# EasyEDA Pro project Access Control Core.eprj, board V2.1.0 Core PCB
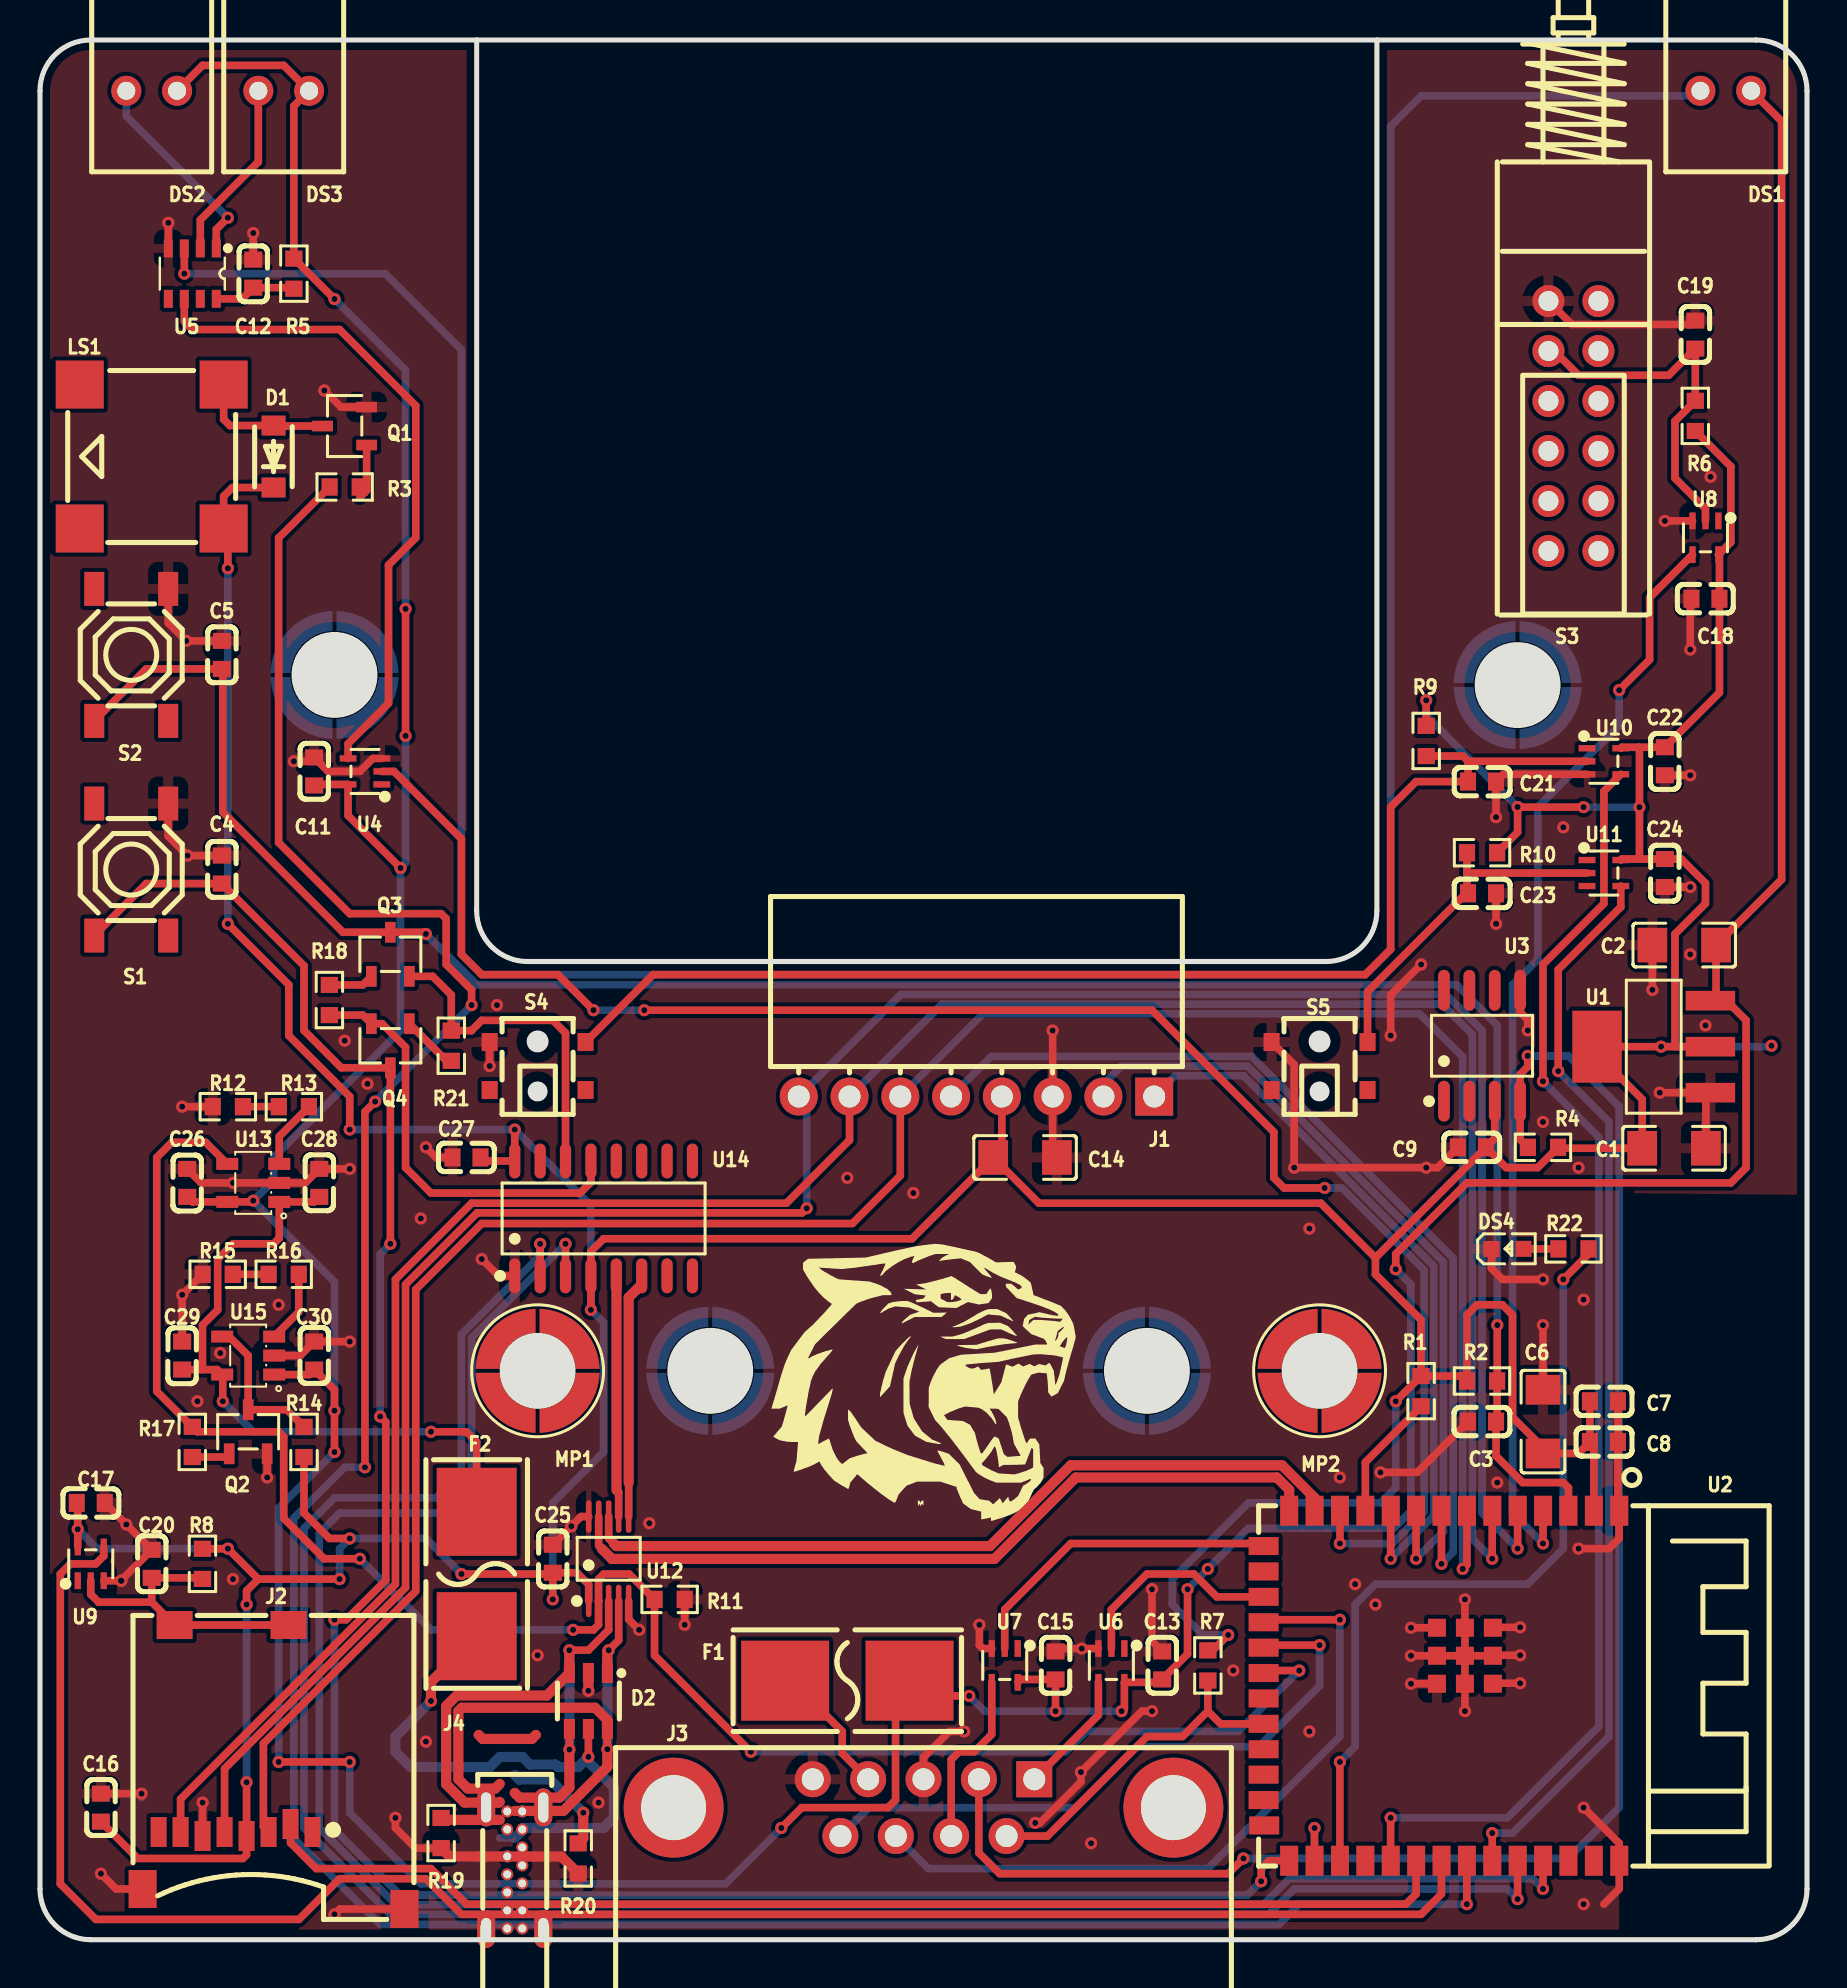
[diagram p7: board, top side]
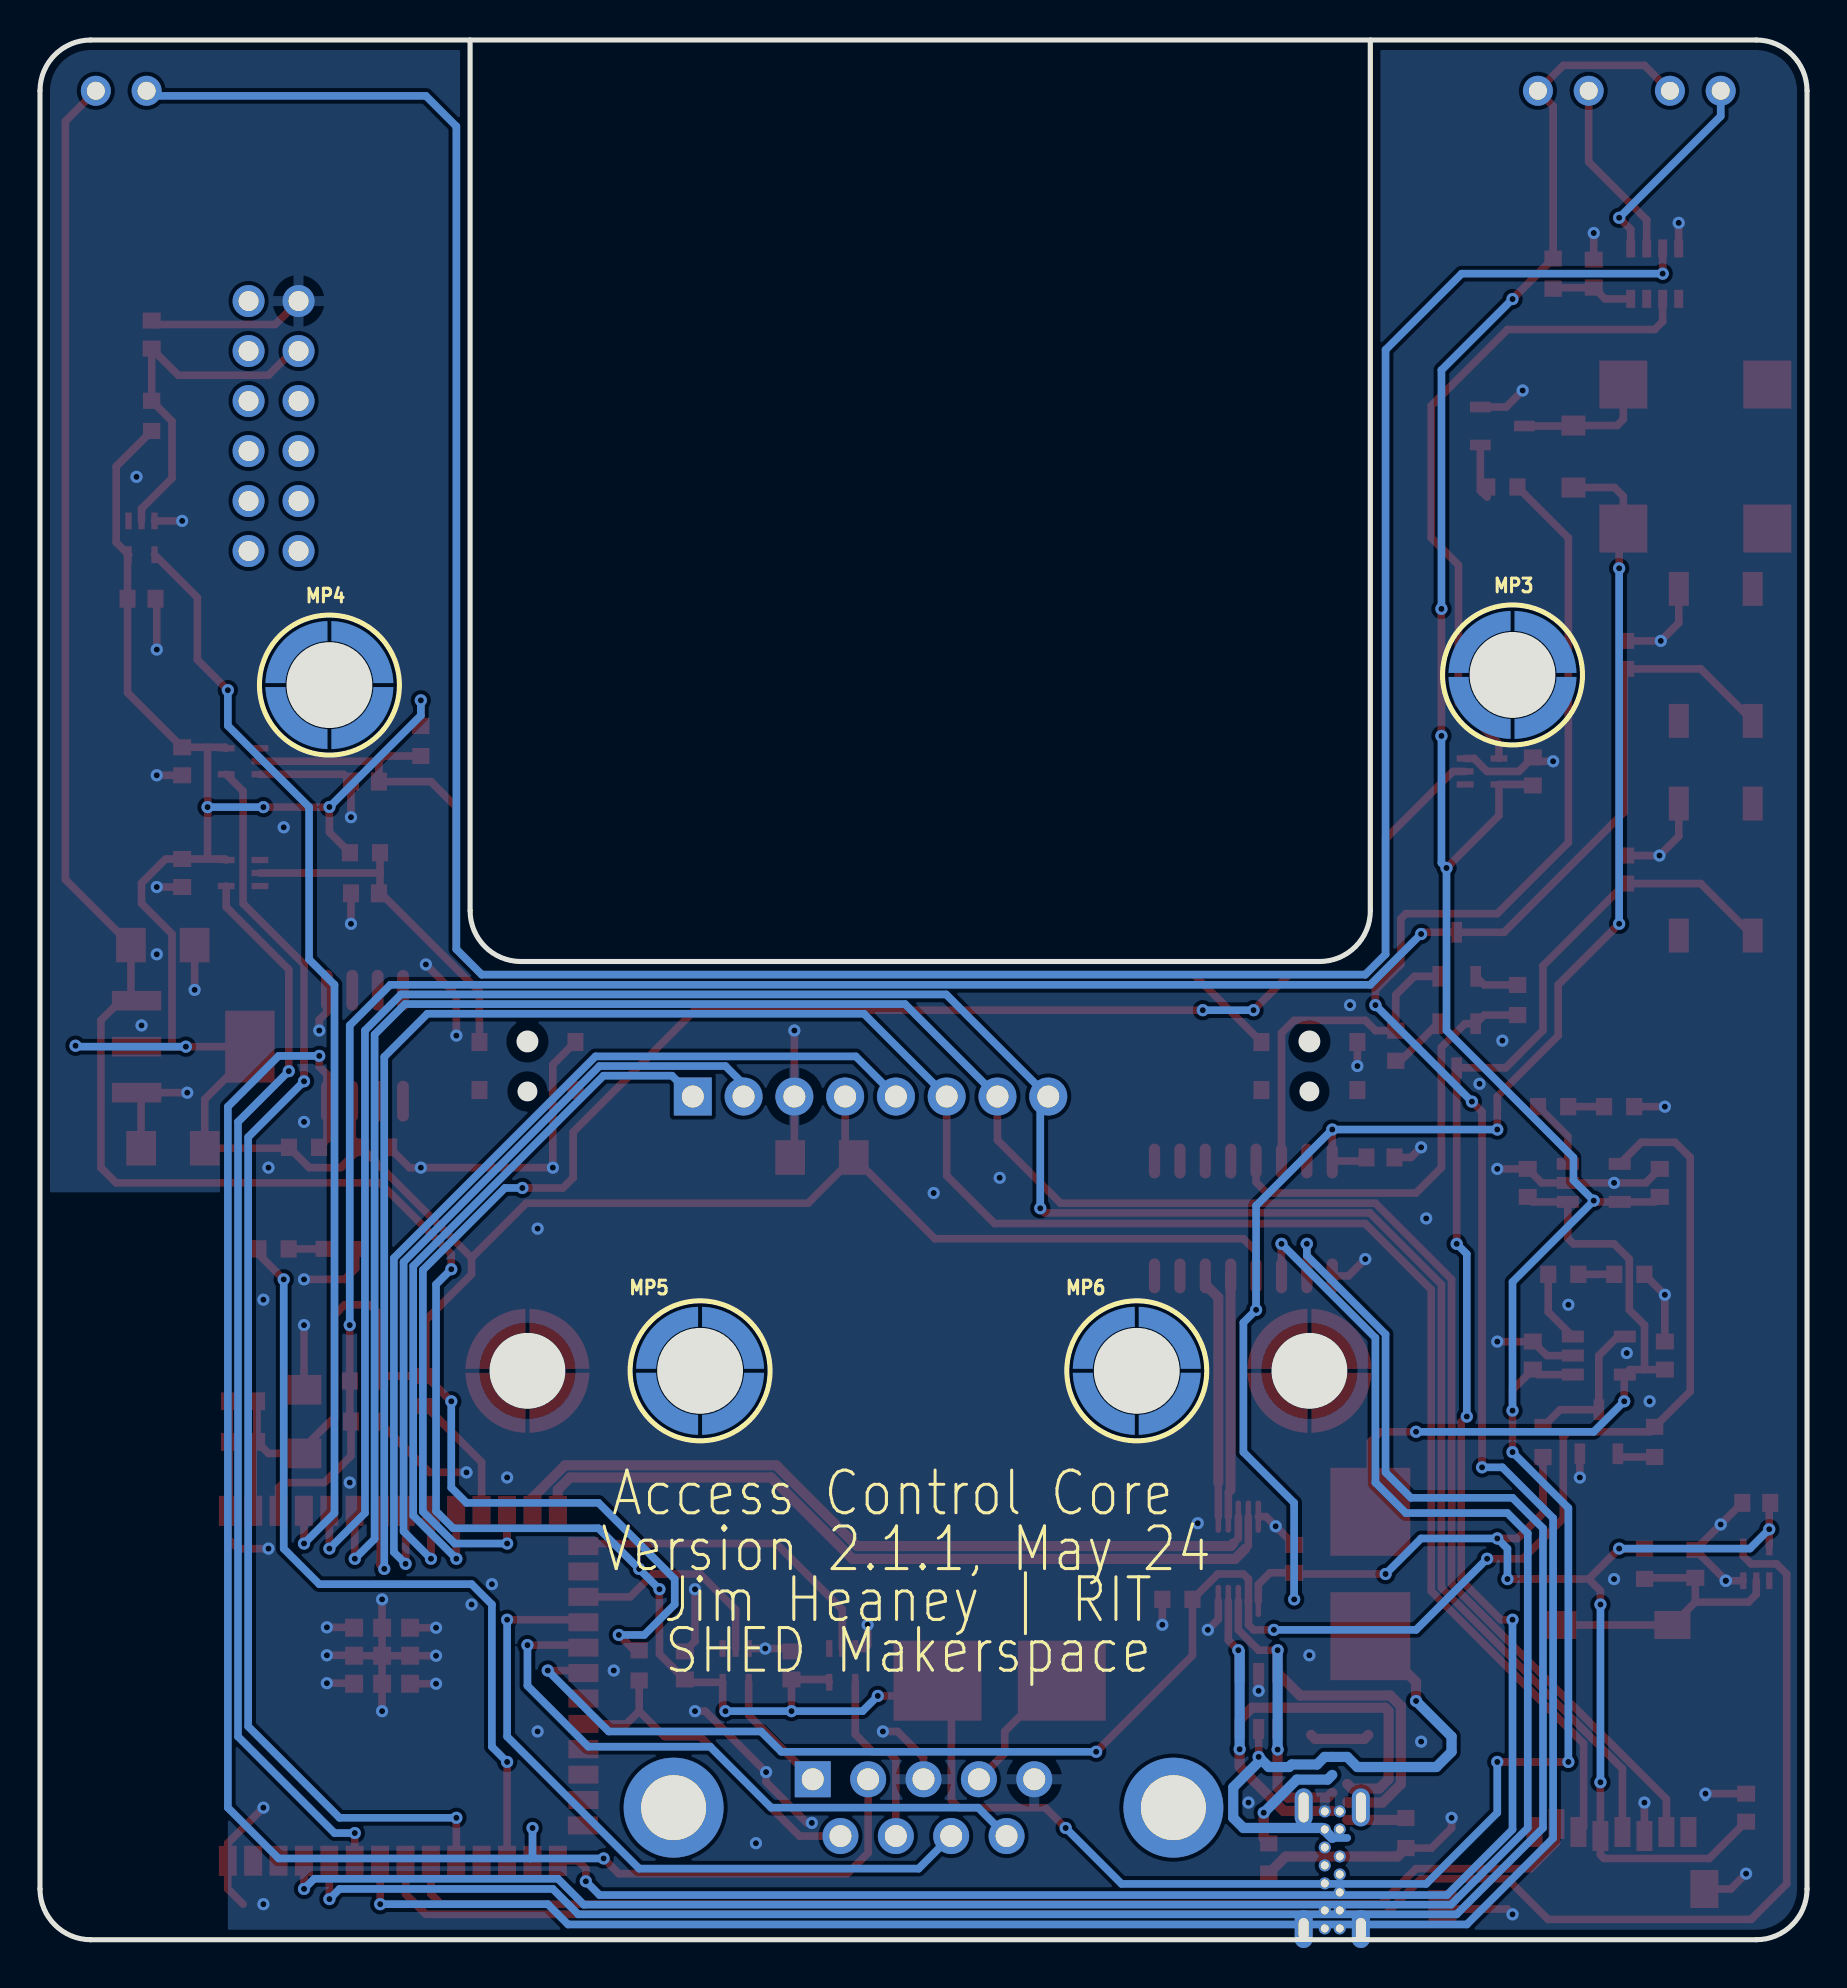
[diagram p8: board, bottom side, seen from below]

Outline 88.39 x 95 mm; copper layers: Top Layer, Bottom Layer. Coordinates in mm from the lower left corner of the outline.
Outline path: 21.84,95 21.84,51.46 arc(22.59,49.66) 24.38,48.92 64.34,48.92 arc(66.13,49.66) 66.88,51.46 66.88,95 ; 0,92.46 0,2.54 arc(0.74,0.74) 2.54,0 85.85,0 arc(87.65,0.74) 88.39,2.54 88.39,92.46 arc(87.65,94.25) 85.85,95 2.54,95 arc(0.74,94.25) 0,92.46
Stack: Top Layer 0.035mm / Dielectric1 1.51mm FR4 er 4.5 / Bottom Layer 0.035mm

## Design rules (mm)
template: Custom Config
spacing copperThickness1oz (default): track to track 0.102, other pairs 0.152 to 0.5
spacing copperThickness2oz: track to track 0.203, other pairs 0.152 to 0.3
track width copperThickness1oz (default): min 0.127, default 0.254, max 2.54
track width copperThickness2oz: min 0.203, default 0.254, max 2.54
differential pair differentialPair (default): width min 0.127, default 0.254, max 2.54; gap min 0.152, default 0.152
via viaSize (default): diameter min 0.5, default 0.61, max 10; hole min 0.3, default 0.305, max 6.3

## Placement (name value [footprint] x y rotation side)
C1  22uF  [C1206]  81.74 39.58 180 top
C2  22uF  [C1206]  82.25 49.74 0 top
C3  1uF  [C0603]  72.14 25.91 0 top
C4  100nF  [C0603]  9.1 53.51 270 top
C5  100nF  [C0603]  9.1 64.25 270 top
C6  22uF  [C1206]  75.18 25.91 270 top
C7  1uF  [C0603]  78.23 26.92 180 top
C8  100nF  [C0603]  78.23 24.89 180 top
C9  100nF  [C0603]  71.63 39.62 0 top
C11  100nF  [C0603]  13.72 58.42 270 top
C12  1uF  [C0603]  10.67 83.31 90 top
C13  100nF  [C0603]  56.13 13.72 270 top
C14  22uF  [C1206]  49.28 39.12 180 top
C15  100nF  [C0603]  50.8 13.72 270 top
C16  100nF  [C0603]  3.05 6.6 270 top
C17  100nF  [C0603]  2.54 21.84 180 top
C18  100nF  [C0603]  83.31 67.06 0 top
C19  100nF  [C0603]  82.8 80.26 270 top
C20  100nF  [C0603]  5.59 18.8 270 top
C21  100nF  [C0603]  72.14 57.91 180 top
C22  100nF  [C0603]  81.28 58.93 90 top
C23  100nF  [C0603]  72.14 52.32 180 top
C24  100nF  [C0603]  81.28 53.34 90 top
C25  100nF  [C0603]  25.65 19.05 90 top
C26  10uF  [C0603]  7.37 37.85 90 top
C27  100nF  [C0603]  21.34 39.12 0 top
C28  10uF  [C0603]  13.97 37.85 270 top
C29  10uF  [C0603]  7.11 29.21 90 top
C30  10uF  [C0603]  13.72 29.21 270 top
D1  SM4007PL  [SOD-123F_L2.8-W1.8-LS3.7-RD]  11.68 74.17 90 top
D2  SRV05-4-P-T7  [SOT-23-6_L2.9-W1.6-P0.95-LS2.8-BR]  27.43 11.94 90 top
DS1  MHK1560UBBTD  [LED-TH_MHK1560UGBTD]  84.33 92.46 180 top
DS2  MHK1560CRBTD  [LED-TH_MHK1560UGBTD]  5.59 92.46 180 top
DS3  MHK1560UGBTD  [LED-TH_MHK1560UGBTD]  12.19 92.46 180 top
DS4  KT-0603R  [LED0603-RD]  73.41 34.54 0 top
F1  0154001.DR  [FUSE-SMD_L9.8-W5.1]  40.39 12.95 180 top
F2  0154001.DR  [FUSE-SMD_L9.8-W5.1]  21.84 18.29 90 top
J1  PM254-1-08-W-8.5  [HDR-TH_8P-P2.54-H-F-W10.0-N]  46.85 42.16 180 top
J2  TF-05  [TF-SMD_TF-05]  11.68 8.64 0 top
J3  D-SUB-DR-9PCM-CB  [DB9-TH_ID09S33E4GV00LF]  44.2 6.6 0 top
J4  XUBF-0314-0907  [TYPE-C-TH_TYPE-C-14P-CC-2.6]  23.75 4.19 0 top
LS1  2.7kHz  [BUZ-SMD_4P-L8.5-W8.5-P8.50-TL]  5.59 74.17 180 top
MP1  SMTSO2070CTJ  [SMD_BD5.6-L5.6-W5.6-D3.6]  24.89 28.45 0 top
MP2  SMTSO2070CTJ  [SMD_BD5.6-L5.6-W5.6-D3.6]  64.01 28.45 0 top
MP3  SMTSO3030CTJ  [SMD_BD5.6-D4.1]  14.73 63.25 0 bottom
MP4  SMTSO3030CTJ  [SMD_BD5.6-D4.1]  73.91 62.74 90 bottom
MP5  SMTSO3030CTJ  [SMD_BD5.6-D4.1]  55.37 28.45 180 bottom
MP6  SMTSO3030CTJ  [SMD_BD5.6-D4.1]  33.53 28.45 180 bottom
Q1  S8050 J3Y  [SOT-23-3_L3.0-W1.7-P0.95-LS2.9-BR]  15.24 75.69 0 top
Q2  S8050 J3Y  [SOT-23-3_L3.0-W1.7-P0.95-LS2.9-BR]  10.41 25.4 270 top
Q3  S8050 J3Y  [SOT-23-3_L3.0-W1.7-P0.95-LS2.9-BR]  17.53 49.28 270 top
Q4  S8050 J3Y  [SOT-23-3_L3.0-W1.7-P0.95-LS2.9-BR]  17.53 44.7 90 top
R1  10kΩ  [R0603]  69.09 27.43 90 top
R2  10kΩ  [R0603]  72.14 27.94 180 top
R3  1kΩ  [R0603]  15.24 72.64 0 top
R4  4.7kΩ  [R0603]  75.18 39.62 0 top
R5  150Ω  [R0603]  12.7 83.31 90 top
R6  100kΩ  [R0603]  82.8 76.2 270 top
R7  5.1kΩ  [R0603]  58.42 13.72 90 top
R8  100kΩ  [R0603]  8.13 18.8 270 top
R9  100kΩ  [R0603]  69.34 59.94 90 top
R10  100kΩ  [R0603]  72.14 54.36 0 top
R11  10kΩ  [R0603]  31.5 17.02 180 top
R12  1kΩ  [R0603]  9.4 41.66 0 top
R13  5.1kΩ  [R0603]  12.7 41.66 180 top
R14  10kΩ  [R0603]  13.21 24.89 90 top
R15  1kΩ  [R0603]  8.89 33.27 0 top
R16  5.1kΩ  [R0603]  12.19 33.27 180 top
R17  10kΩ  [R0603]  7.62 24.89 90 top
R18  10kΩ  [R0603]  14.48 46.99 90 top
R19  5.1kΩ  [R0603]  20.07 5.33 90 top
R20  5.1kΩ  [R0603]  26.92 4.06 90 top
R21  10kΩ  [R0603]  20.57 44.7 270 top
R22  4.7kΩ  [R0603]  76.71 34.54 0 top
S1  TS-1187A-B-A-B  [SW-SMD_4P-L5.1-W5.1-P3.70-LS6.5-TL-2]  4.56 53.51 90 top
S2  TS-1187A-B-A-B  [SW-SMD_4P-L5.1-W5.1-P3.70-LS6.5-TL-2]  4.56 64.25 90 top
S3  SPUJ194500  [SW-TH_SPUJ194500]  76.71 75.69 90 top
S4  TS-103  [SW-SMD_TS-103]  24.89 43.69 90 top
S5  TS-103  [SW-SMD_TS-103]  64.01 43.69 90 top
U1  AMS1117-3.3  [SOT-223-4_L6.5-W3.5-P2.30-LS7.0-BR]  80.72 44.66 0 top
U2  2.4GHz  [WIRELM-SMD_ESP32-S3-WROOM-1]  70.1 12.7 270 top
U3  DS18B20Z+T&R  [SOIC-8_L4.9-W3.9-P1.27-LS6.0-BL]  72.14 44.7 0 top
U4  74LVC1G17GW,125  [SOT-353_L2.1-W1.3-P0.65-LS2.3-BR]  16.26 58.42 0 top
U5  WS2811F  [FSOP-8_L3.3-W1.7-P0.80-LS2.9-BL]  7.62 83.31 180 top
U6  74LVC1G17GW,125  [SOT-353_L2.1-W1.3-P0.65-LS2.3-BR]  53.59 13.72 90 top
U7  74LVC1G17GW,125  [SOT-353_L2.1-W1.3-P0.65-LS2.3-BR]  48.26 13.72 90 top
U8  74LVC1G17GW,125  [SOT-353_L2.1-W1.3-P0.65-LS2.3-BR]  83.31 70.1 90 top
U9  74LVC1G17GW,125  [SOT-353_L2.1-W1.3-P0.65-LS2.3-BR]  2.54 18.8 270 top
U10  74LVC1G17GW,125  [SOT-353_L2.1-W1.3-P0.65-LS2.3-BR]  78.23 58.93 180 top
U11  74LVC1G17GW,125  [SOT-353_L2.1-W1.3-P0.65-LS2.3-BR]  78.23 53.34 180 top
U12  FSUSB42MUX  [MSOP-10_L3.0-W3.0-P0.50-LS5.0-BL]  28.45 19.05 0 top
U13  MT9700  [SOT-23-5_L3.0-W1.7-P0.95-LS2.8-BR]  10.67 37.85 0 top
U14  CH340C  [SOP-16_L10.0-W3.9-P1.27-LS6.0-BL]  28.19 36.07 0 top
U15  MT9700  [SOT-23-5_L3.0-W1.7-P0.95-LS2.8-BR]  10.41 29.21 0 top

## Footprints (pads in the part's own frame, mm; a bottom-side part is the same pattern mirrored in y, then rotated)
BUZ-SMD_4P-L8.5-W8.5-P8.50-TL
  rect 2.4x2.4 smd: 1(-3.6,3.6) 2(-3.6,-3.6) 3(3.599,-3.599) 4(3.6,3.6)
C0603
  rect 0.8x0.9 smd: 1(-0.7,0) 2(0.7,0)
C1206
  rect 1.485x1.728 smd: 1(-1.593,0) 2(1.593,0)
DB9-TH_ID09S33E4GV00LF
  rect 1.8x1.8 hole 1.1: 1(5.54,1.42)
  round 1.8 hole 1.1: 2(2.77,1.42) 3(0,1.42) 4(-2.77,1.42) 5(-5.54,1.42) 6(4.155,-1.42) 7(1.385,-1.42) 8(-1.385,-1.42) 9(-4.155,-1.42)
  round 5 hole 3.25: 10(-12.5,0) 11(12.5,0)
FSOP-8_L3.3-W1.7-P0.80-LS2.9-BL
  rect 0.45x0.9 smd: 1(-1.2,-1.26) 2(-0.4,-1.26) 3(0.4,-1.26) 4(1.2,-1.26) 5(1.2,1.26) 6(0.4,1.26) 7(-0.4,1.26) 8(-1.2,1.26)
FUSE-SMD_L9.8-W5.1
  rect 4.4x4 smd: 1(-3.11,0) 2(3.11,0)
HDR-TH_8P-P2.54-H-F-W10.0-N
  rect 1.9x1.9 hole 1.1: 1(-8.89,0)
  round 1.9 hole 1.1: 2(-6.35,0) 3(-3.81,0) 4(-1.27,0) 5(1.27,0) 6(3.81,0) 7(6.35,0) 8(8.89,0)
LED0603-RD
  rect 0.8x0.8 smd: 1(-0.799,-0.004) 2(0.799,0.004)
LED-TH_MHK1560UGBTD
  round 1.5 hole 0.9: 1(1.27,0) 2(-1.27,0)
MSOP-10_L3.0-W3.0-P0.50-LS5.0-BL
  oval 0.28x1.62 smd: 1(-1,-2.11) 2(-0.5,-2.11) 3(0,-2.11) 4(0.5,-2.11) 5(1,-2.11) 6(1,2.11) 7(0.5,2.11) 8(0,2.11) 9(-0.5,2.11) 10(-1,2.11)
R0603
  rect 0.806x0.864 smd: 1(-0.753,0) 2(0.753,0)
SMD_BD5.6-D4.1
  custom 3.1x3.1 smd: 1(-2.102,1.65) 2(1.65,2.102) 3(2.102,-1.65) 4(-1.65,-2.102)
SMD_BD5.6-L5.6-W5.6-D3.6
  custom 3x3 smd: 1(-1.844,1.6) 1(-1.601,-1.844) 1(1.6,1.844) 1(1.844,-1.6)
SOD-123F_L2.8-W1.8-LS3.7-RD
  rect 1x1.2 smd: 1(-1.55,0) 2(1.55,0)
SOIC-8_L4.9-W3.9-P1.27-LS6.0-BL
  oval 0.588x2.045 smd: 1(-1.905,-2.772) 2(-0.635,-2.772) 3(0.635,-2.772) 4(1.905,-2.772) 5(1.905,2.772) 6(0.635,2.772) 7(-0.635,2.772) 8(-1.905,2.772)
SOP-16_L10.0-W3.9-P1.27-LS6.0-BL
  oval 0.56x1.745 smd: 1(-4.445,-2.873) 2(-3.175,-2.873) 3(-1.905,-2.873) 4(-0.635,-2.873) 5(0.635,-2.873) 6(1.905,-2.873) 7(3.175,-2.873) 8(4.445,-2.873) 9(4.445,2.873) 10(3.175,2.873) 11(1.905,2.873) 12(0.635,2.873) 13(-0.635,2.873) 14(-1.905,2.873) 15(-3.175,2.873) 16(-4.445,2.873)
SOT-23-3_L3.0-W1.7-P0.95-LS2.9-BR
  rect 1.038x0.532 smd: 1(1.101,-0.95) 2(1.101,0.95) 3(-1.101,0)
SOT-23-5_L3.0-W1.7-P0.95-LS2.8-BR
  rect 1.1x0.6 smd: 1(1.3,-0.95) 2(1.3,0) 3(1.3,0.95) 4(-1.3,0.95) 5(-1.3,-0.95)
SOT-23-6_L2.9-W1.6-P0.95-LS2.8-BR
  rect 1x0.55 smd: 1(1.4,-0.95) 2(1.4,0) 3(1.4,0.95) 4(-1.4,0.95) 5(-1.4,0) 6(-1.4,-0.95)
SOT-223-4_L6.5-W3.5-P2.30-LS7.0-BR
  rect 2.47x0.98 smd: 1(2.835,-2.3) 2(2.835,0) 3(2.835,2.3)
  rect 2.47x3.6 smd: 4(-2.835,0)
SOT-353_L2.1-W1.3-P0.65-LS2.3-BR
  rect 0.839x0.315 smd: 1(0.845,-0.65) 2(0.845,0) 3(0.845,0.65) 4(-0.845,0.65) 5(-0.845,-0.65)
SW-SMD_4P-L5.1-W5.1-P3.70-LS6.5-TL-2
  rect 1.7x1 smd: 1(-3.3,1.85) 2(3.3,1.85) 3(-3.3,-1.85) 4(3.3,-1.85)
SW-SMD_TS-103
  rect 0.9x0.8 smd: 1(1.2,2.4) 2(1.2,-2.4) 3(-1.2,2.4) 4(-1.2,-2.4)
SW-TH_SPUJ194500
  round 1.6 hole 1: 1(6.25,-1.25) 2(3.75,-1.25) 3(1.25,-1.25) 4(-1.25,-1.25) 5(-3.75,-1.25) 6(-6.25,-1.25) 7(6.25,1.25) 8(3.75,1.25) 9(1.25,1.25) 10(-1.25,1.25) 11(-3.75,1.25) 12(-6.25,1.25)
TF-SMD_TF-05
  rect 0.8x1.5 smd: 1(1.95,-3.25) 2(0.85,-2.85) 3(-0.25,-3.25) 4(-1.35,-3.45) 5(-2.45,-3.25) 6(-3.55,-3.45) 7(-4.65,-3.25) 8(-5.75,-3.25)
  rect 1.8x1.4 smd: 9(-4.95,7.1) 10(0.75,7.1)
  rect 1.4x1.9 smd: 11(-6.55,-6.1) 11(6.55,-7.1)
TYPE-C-TH_TYPE-C-14P-CC-2.6
  round 0.6 hole 0.4x0.42: A1(0.375,2.225) A4(0.375,1.325) A5(0.375,0.425) A6(0.375,-0.475) A7(0.375,-1.375) A9(0.375,-2.725) A12(0.375,-3.625) B1(-0.375,-3.625) B4(-0.375,-2.725) B5(-0.375,-1.825) B6(-0.375,-0.925) B7(-0.375,-0.025) B9(-0.375,1.325) B12(-0.375,2.225)
  oval 0.9x1.9 hole 0.5x1.5: SH1(1.43,2.425) SH2(-1.43,2.425)
  oval 0.9x1.9 hole 0.5x1.1: SH1(1.43,-3.655) SH2(-1.43,-3.655)
WIRELM-SMD_ESP32-S3-WROOM-1
  rect 1.5x0.9 smd: 1(-8.75,8.895) 2(-8.75,7.625) 3(-8.75,6.355) 4(-8.75,5.085) 5(-8.75,3.815) 6(-8.75,2.545) 7(-8.75,1.275) 8(-8.75,0.005) 9(-8.75,-1.265) 10(-8.75,-2.535) 11(-8.75,-3.805) 12(-8.75,-5.075) 13(-8.75,-6.345) 14(-8.75,-7.615) 27(8.75,-7.615) 28(8.75,-6.345) 29(8.75,-5.075) 30(8.75,-3.805) 31(8.75,-2.535) 32(8.75,-1.265) 33(8.75,0.005) 34(8.75,1.275) 35(8.75,2.545) 36(8.75,3.815) 37(8.75,5.085) 38(8.75,6.355) 39(8.75,7.625) 40(8.75,8.895)
  rect 0.9x1.5 smd: 15(-6.985,-8.895) 16(-5.715,-8.895) 17(-4.445,-8.895) 18(-3.175,-8.895) 19(-1.905,-8.895) 20(-0.635,-8.895) 21(0.635,-8.895) 22(1.905,-8.895) 23(3.175,-8.895) 24(4.445,-8.895) 25(5.715,-8.895) 26(6.985,-8.865)
  rect 0.9x0.9 smd: 41(-2.9,2.575) 41(-2.9,1.175) 41(-2.9,-0.225) 41(-1.5,2.575) 41(-1.5,1.175) 41(-1.5,-0.225) 41(-0.1,2.575) 41(-0.1,1.175) 41(-0.1,-0.225)

## Nets
As in the schematic, except:
GND: C1.1 C2.1 C3.1 C4.1 C5.1 C6.1 C7.1 C8.1 C9.1 C11.1 C12.2 C13.1 C14.1 C15.1 C16.1 C17.1 C18.1 C19.1 C20.1 C21.1 C22.1 C23.1 C24.1 C25.2 C26.2 C27.1 C28.1 C29.2 C30.1 D2.2 DS4.1 J1.3 J2.6 J2.11 J3.3 J3.5 J4.A1 J4.A12 J4.B1 J4.B12 J4.SH1 J4.SH2 Q1.2 Q2.2 R11.1 R12.1 R15.1 R19.1 R20.1 S1.4 S2.4 S3.7 S4.1 S5.1 U1.1 U2.1 U2.40 U2.41 U3.5 U4.3 U5.4 U6.3 U7.3 U8.3 U9.3 U10.3 U12.5 U12.10 U13.2 U14.1 U15.2

Pads without a net: J2 1 8; J3 10 11; LS1 3 4; MP1 1; MP2 1; MP3 1 2 3 4; MP4 1 2 3 4; MP5 1 2 3 4; MP6 1 2 3 4; S1 2 3; S2 2 3; S3 1 2 3 4 5 6 9 10 11 12; S4 3 4; S5 3 4; U2 16 21 23 24 25 26 30 38 39; U3 1 2 6 7 8; U4 1; U5 5 7; U6 1; U7 1; U8 1; U9 1; U10 1; U11 1 3; U14 7 8 9 10 11 12 15

## Via types
v1: diameter 0.61, hole 0.305, Top Layer to Bottom Layer, 181 vias

## Routing (per net, layer and track width the routed paths; a pad name or vN(x,y) marks a point on that pad's centre or on a via; arc(x,y) is an arc through that point)
+5V: length 283.4
  Top Layer w0.381: v1(54.1,11.43) 54.24,11.57 U6.5 55.99,12.87 C13.2 57.4,14.29 v1(57.4,17.53) ; C26.1 7.62,36.9 U13.5 10.47,36.9 10.54,36.96 v1(10.67,36.96) ; U7.5 49.05,13.02 C15.2 v1(50.8,11.43) ; v1(14.73,24.38) v1(14.73,26.46) 14.73,27.49 C30.2 13.47,28.26 U15.1 ; C11.2 13.77,57.77 U4.5 15.41,56.22 v1(18.03,53.59) ; v1(18.29,60.2) v1(18.29,66.55) ; v1(46.48,12.19) 44.26,12.19 F1.1 42.8,12.26 42.8,6.99 42.42,6.6 38.1,6.6 v1(37.08,5.59) ; v1(11.94,8.89) v1(15.49,8.89) ; v1(14.73,82.04) 12.71,84.07 R5.2 12.7,91.69 DS3.2 12.19,93.73 8.13,93.73 DS2.2 ; DS1.2 87.12,90.93 87.12,53.02 C2.2 83.84,47.24 U1.3 84.36,46.96 85.34,45.97 85.34,38.61 84.58,37.85 71.37,37.85 67.82,34.29 v1(67.82,33.53)
  Bottom Layer w0.381: v1(15.49,8.89) 15.49,6.35 19.05,2.79 34.29,2.79 v1(37.08,5.59) ; v1(18.29,66.55) 18.29,78.49 v1(14.73,82.04) ; v1(14.73,24.38) 11.94,21.59 v1(11.94,8.89) ; v1(18.29,60.2) 18.29,53.85 v1(18.03,53.59) 18.03,45.47 11.68,39.12 11.68,37.97 v1(10.67,36.96) 14.73,32.89 v1(14.73,26.46) ; v1(54.1,11.43) v1(50.8,11.43) 47.24,11.43 v1(46.48,12.19) ; v1(57.4,17.53) v1(58.42,18.54) 60.45,20.57 67.72,20.57 68.58,21.43 68.58,32.77 v1(67.82,33.53)
GND: length 201.3
  Top Layer w0.381: Q1.2 15.05,76.64 v1(14.22,77.47) ; C14.1 50.66,39.33 J1.3 v1(50.66,45.47) ; DS4.1 72.61,33.57 73.15,33.02 v1(75.18,33.02) ; v1(74.04,15.62) 72.7,15.62 72.68,15.6 ; v1(55.63,11.43) 55.12,11.43 v1(52.07,8.38) 52.07,7.89 50.03,5.84 v1(49.78,5.84) ; U2.41 v1(68.58,15.6) ; v1(74.42,45.47) 74.42,46.01 74.04,46.39 U3.5 ; v1(67.56,45.21) 67.56,47.24 v1(69.09,48.77) ; C9.1 69.91,38.61 v1(69.34,38.61) v1(62.74,38.61) 62.74,43.76 S5.1 ; v1(82.55,64.52) 82.55,66.99 C18.1 ; 6.41,67.55 6.41,65.85 v1(7.31,64.95) C5.1 ; v1(74.04,14.22) 72.7,14.22 72.68,14.2 U2.41 ; v1(12.7,58.93) 13.52,58.93 C11.1 14.42,58.42 16,58.42 16.65,59.07 U4.3 ; 6.41,56.81 6.41,55.18 v1(7.38,54.21) C4.1 ; C12.2 v1(10.67,85.34) ; v1(3.05,3.3) 3.81,2.54 J2.11 ; C2.1 v1(80.66,47.5) ; R12.1 v1(7.11,41.66) ; v1(46.23,10.41) 45.5,10.41 44.2,9.11 J3.3 ; C1.1 83.33,42.13 U1.1 v1(81.03,42.36) ; U2.41 v1(68.58,12.8) ; v1(22.1,34.04) 22.94,33.2 U14.1 ; U8.3 v1(81.28,70.95) ; S4.1 v1(22.49,43.69) ; U2.41 U2.41 v1(71.28,11.43) ; U2.41 U2.41 v1(68.58,14.2) ; U2.41 U2.41 v1(71.28,17.02) ; C25.2 v1(26.58,20.68) 27.06,21.16 U12.10 ; C27.1 19.81,39.12 v1(19.3,39.62) ; U10.3 73.2,58.28 C21.1 v1(72.84,56.13) ; v1(29.97,15.49) 29.45,16.02 U12.5 ; C17.1 v1(4.32,20.77) C20.1 4.06,17.97 v1(4.06,17.95) U9.3 ; S3.7 76.63,80.77 82.61,80.77 C19.1 ; J2.11 15,1.54 v1(14.73,1.27) ; v1(46.99,15.75) 46.99,14.73 47.16,14.56 U7.3 ; R15.1 v1(7.11,32.25) C29.2 ; C6.1 v1(75.18,30.73) ; v1(55.63,17.53) 55.63,14.92 C13.1 ; v1(74.04,12.83) 72.71,12.83 72.68,12.8 ; v1(76.96,19.56) 78.49,19.56 78.99,20.07 78.99,21.45 U2.1 78.93,21.52 C8.1 C7.1 ; J2.6 v1(8.13,6.86) ; C16.1 v1(5.08,7.3) ; v1(67.06,23.37) 68.9,23.37 C3.1 ; U15.2 13.02,29.21 C30.1 v1(15.49,29.91) ; C24.1 v1(82.55,52.64) ; U5.4 v1(6.42,85.85) ; 78.23,1.78 79,2.55 U2.40 79,4.82 v1(77.22,6.6) ; C23.1 v1(72.84,50.8) ; C22.1 v1(82.55,58.23) ; Q2.2 v1(11.36,23.11) ; U6.3 v1(52.11,14.56) 50.94,14.56 C15.1 ; C26.2 8.07,37.85 v1(9.65,37.85) U13.2 13.27,37.85 C28.1 v1(15.49,38.55) ; R19.1 18.79,4.58 17.78,5.59 v1(17.78,6.1) ; R11.1 v1(32.25,15.75)
  Top Layer w0.508: 21.94,10.24 22.14,10.04 24.6,10.04 24.8,10.24 ; R20.1 26.07,4.16 20.48,4.16 R19.1 ; D2.2 v1(27.43,12.45)
  Bottom Layer w0.381: v1(82.55,58.23) 82.55,58.17 ; v1(72.84,56.13) 72.9,56.13 ; v1(5.08,7.3) 5.08,7.11 ; v1(8.13,6.86) 8.13,6.86 ; v1(81.03,42.36) 81.03,42.42
  vias: v1(7.87,26.92) v1(9.02,29.34) v1(9.65,18.03) v1(11.94,31.75) v1(15.24,44.96) v1(16.38,42.8) v1(19.05,36.07) v1(19.3,9.91) v1(22.86,46.74) v1(24.89,14.22) v1(27.94,6.86) v1(30.48,20.83) v1(40.39,38.1) v1(43.69,37.34) v1(52.58,4.83) v1(59.69,13.46) v1(63.5,35.56) v1(63.5,10.41) v1(65.02,23.11) v1(65.79,17.78) v1(66.8,16.76) v1(72.9,22.86) v1(75.18,40.89) v1(76.2,55.63) v1(76.96,38.61) v1(77.22,32) v1(77.22,1.78) v1(82.55,49.28) v1(83.31,45.72) v1(83.57,73.15)
VCC: length 336.3
  Top Layer w0.381: C16.2 4.89,4.06 10.15,4.06 10.33,4.25 J2.4 v1(10.33,7.87) ; U3.3 72.77,40.07 C9.2 ; U10.5 79.13,59.63 79.99,59.63 ; 81.79,44.66 v1(81.09,44.66) U1.4 77.89,44.28 80.15,42.03 C1.2 75.98,39.58 R4.2 74.92,38.61 73.34,38.61 C9.2 ; 81.79,44.66 81.79,50.29 83.31,51.82 83.31,52.83 82.1,54.04 C24.2 80.01,54.04 ; 81.79,44.66 U1.2 ; C25.1 26.86,18.35 27.45,17.76 U12.1 ; C25.1 v1(25.65,17.02) ; C25.1 25.59,18.29 v1(21.08,18.29) ; C14.2 49.97,36.83 64.07,36.83 66.8,34.1 ; C14.2 43.62,35.05 28.19,35.05 27.56,34.42 U14.4 v1(27.56,31.5) ; C14.2 48.12,39.55 J1.4 ; 75.48,24.32 73.66,26.13 73.66,31.24 73.15,31.75 71.88,31.75 71.38,31.25 R2.2 71.14,28.19 R1.2 ; 75.48,24.32 C6.2 ; 75.48,24.32 76.96,24.32 C8.2 ; 80.01,54.04 79.13,54.04 U11.5 ; 80.01,54.04 v1(80.01,56.64) 80.01,59.61 79.99,59.63 ; C8.2 C7.2 ; C8.2 77.73,24.7 U2.2 ; v1(9.4,68.58) 9.4,70.36 LS1.1 9.19,72.18 9.63,72.62 D1.1 ; v1(14.99,18.03) 10.92,18.03 ; 10.92,18.03 9.41,19.55 ; 10.92,18.03 10.33,17.45 v1(10.33,16.76) ; R10.2 73.91,55.38 v1(73.91,56.64) 73.92,56.64 v1(77.22,56.64) ; 9.41,19.55 R8.1 ; 9.41,19.55 v1(9.4,19.56) ; R6.2 84.58,73.67 84.58,69.88 U8.5 84.01,69.21 C18.2 84.01,62.36 C22.2 79.99,59.63 ; v1(69.34,61.98) R9.2 ; R1.2 69.09,30.99 66.8,33.27 66.8,34.1 ; R1.2 69.08,28.19 v1(67.82,26.92) ; v1(15.49,20.07) 14.48,20.07 13.21,21.34 R14.1 ; v1(9.4,50.8) 12.45,47.75 12.45,45.21 15.49,42.16 v1(15.49,40.51) ; C9.2 66.8,34.1 ; v1(59.44,15.24) 58.67,14.47 R7.2 ; U9.5 v1(1.89,20.53) 1.89,21.79 C17.2 ; v1(23.75,40.51) U14.16 22.21,38.94 C27.2
  Bottom Layer w0.381: v1(59.44,15.24) 58.17,15.24 56.64,16.76 56.64,18.03 60.45,21.84 67.06,21.84 67.82,22.61 v1(67.82,26.92) ; v1(14.99,18.03) 14.99,19.56 v1(15.49,20.07) 19.3,20.07 v1(21.08,18.29) ; v1(81.09,44.66) 86.57,44.66 v1(86.61,44.7) ; v1(73.91,56.64) 69.34,61.21 v1(69.34,61.98) ; v1(9.4,19.56) 2.86,19.56 v1(1.89,20.53) ; v1(9.4,50.8) v1(9.4,68.58) ; v1(80.01,56.64) v1(77.22,56.64) ; v1(10.33,7.87) v1(10.33,16.76) ; v1(25.65,17.02) 25.65,21.84 28.19,24.38 28.19,30.86 v1(27.56,31.5) 27.56,36.7 v1(23.75,40.51) v1(15.49,40.51)
BUTTON: length 55.4
  Top Layer w0.381: v1(78.99,62.48) 80.52,64.01 80.52,67.12 U8.4 ; U2.4 75.18,21.45 v1(75.18,19.81)
  Bottom Layer w0.381: v1(75.18,19.81) 73.66,21.34 73.66,47.75 74.93,49.02 74.93,56.64 78.99,60.71 v1(78.99,62.48)
BUZZER: length 142.6
  Top Layer w0.381: v1(71.37,1.78) 71.37,3.95 U2.34 ; R3.1 11.94,70.1 11.94,54.86 15.49,51.31 20.07,51.31 20.32,51.05 20.32,48.77 21.59,47.5 v1(21.59,46.74) ; v1(16.76,41.91) 16.26,41.4 v1(16.26,23.62)
  Bottom Layer w0.381: v1(71.37,1.78) 62.99,1.78 61.98,0.76 17.02,0.76 12.7,5.08 12.7,21.08 15.24,23.62 v1(16.26,23.62) ; v1(21.59,46.74) v1(16.76,41.91)
CS_NFC: length 48.3
  Top Layer w0.381: U2.8 70.1,21.45 v1(70.1,18.8)
  Bottom Layer w0.381: v1(70.1,18.8) 70.69,19.38 70.69,34.09 60.6,44.17 47.58,44.17 J1.5
CS_SD: length 60.4
  Top Layer w0.381: J2.2 12.53,4.85 13.82,3.56 19.56,3.56 21.34,1.78 68.33,1.78 68.83,2.29 68.83,3.95 U2.32
DEBUG_LED: length 40.2
  Top Layer w0.381: v1(65.02,8.89) 65.02,3.96 U2.29 ; R22.2 77.46,34.28 v1(76.2,33.02)
  Bottom Layer w0.381: v1(76.2,33.02) 76.2,19.56 74.42,17.78 66.8,17.78 65.79,16.76 65.79,9.65 v1(65.02,8.89)
DM_IN: length 30.2
  Top Layer w0.381: v1(28.38,9.53) D2.6 ; U12.4 28.95,14.98 v1(28.45,14.48)
  Top Layer w0.508: 23,7.79 22.77,7.56 21.4,7.56 20.93,8.03 20.93,11.43 21.1,11.6 27.77,11.6 28.38,10.99 D2.6 ; v1(28.38,9.53) 28.38,8.64 26.18,6.44 23.75,6.44 ; v1(28.45,14.48) 28.38,14.41 D2.1
  Bottom Layer w0.508: v1(28.38,9.53) 28.38,14.41 v1(28.45,14.48)
DN_HID: length 39.6
  Top Layer w0.381: U12.8 28.45,20.07 28.7,19.81
  Top Layer w0.508: U2.13 63.76,22.09 62.13,23.72 51.56,23.72 47.52,19.69 28.83,19.69 28.7,19.81
DN_UART: length 12.3
  Top Layer w0.381: U12.6 29.45,22.86
  Top Layer w0.508: U14.6 30.1,32.77 29.45,32.12 29.45,22.86
DP_HID: length 39.3
  Top Layer w0.381: 28.1,19.55 27.95,19.7 U12.9
  Top Layer w0.508: 28.1,19.55 28.61,19.04 47.74,19.04 51.82,23.11 61.88,23.11 62.49,22.5 U2.14
DP_IN: length 29.7
  Top Layer w0.381: U12.3 28.45,15.49 27.43,14.48 v1(26.48,14.48) ; v1(26.48,9.51) D2.4
  Top Layer w0.508: v1(26.48,9.51) 26.48,7.61 25.98,7.11 23.98,7.11 23.75,7.34 ; v1(26.48,14.48) D2.3 25.35,12.21 20.85,12.21 20.32,11.68 20.32,7.77 21.24,6.86 22.97,6.86 23,6.89
  Bottom Layer w0.508: v1(26.48,9.51) v1(26.48,14.48)
DP_UART: length 12.1
  Top Layer w0.381: U12.7 28.95,22.38 28.84,22.49
  Top Layer w0.508: 28.84,22.49 28.84,33.19 U14.5
DTR: length 21.6
  Top Layer w0.381: R18.1 16.14,46.24 Q4.2 17.11,45.81 18.29,44.63 18.29,38.61 19.56,37.34 27.02,37.34 27.56,37.88 U14.13
EN: length 109.8
  Top Layer w0.381: S2.1 5.31,63.55 C5.2 9.14,63.5 9.14,56.39 15.15,50.38 Q3.3 19.22,50.38 v1(19.3,50.29) ; v1(72.9,30.73) 72.9,27.95 R2.1 72.89,25.96 C3.2 72.84,24.19 74.17,22.86 76.2,22.86 76.46,22.6 76.46,21.45
  Bottom Layer w0.381: v1(72.9,30.73) 72.9,45.72 70.87,47.75 21.84,47.75 v1(19.3,50.29)
GPIO0: length 111.6
  Top Layer w0.381: U2.27 61.48,3.95 61.09,3.56 v1(61.09,2.92) ; v1(14.73,16) 15.32,16 17.3,17.98 17.3,25.88 v1(17.02,26.16) ; v1(17.53,34.8) Q4.3 15.07,43.6 13.21,45.47 13.21,48.7 C4.2 5.31,52.81 S1.1
  Bottom Layer w0.381: v1(14.73,16) 14.73,5.51 18.01,2.24 60.4,2.24 v1(61.09,2.92) ; v1(17.02,26.16) 17.02,34.29 v1(17.53,34.8)
IO18: length 6.4
  Top Layer w0.381: R1.1 69.09,26.67 66.3,23.88 66.3,21.45
IRQ: length 39.9
  Top Layer w0.381: v1(68.83,19.05) 68.83,21.45 U2.9
  Bottom Layer w0.381: J1.2 53.2,42.78 54.1,43.69 60.4,43.69 70.2,33.89 70.2,20.42 v1(68.83,19.05)
LED: length 85.8
  Top Layer w0.381: v1(30.23,46.48) 55.63,46.48 61.72,40.39 61.72,38.1 62.23,37.59 v1(64.26,37.59) ; U4.2 17.71,58.42 21.08,55.05 21.08,49.28 22.1,48.26 25.91,48.26 v1(27.69,46.48) ; U2.12 65.03,19.82 v1(65.02,19.81)
  Bottom Layer w0.381: v1(65.02,19.81) 67.64,19.81 69.24,21.41 69.24,33.49 65.13,37.59 v1(64.26,37.59) ; v1(27.69,46.48) v1(30.23,46.48)
LED_LINK: length 33.5
  Top Layer w0.381: U5.6 7.22,80.92 7.62,80.52 14.99,80.52 18.8,76.71 18.8,70.1 17.44,68.74 17.44,61.83 15.41,59.81 U4.4
MISO: length 122.6
  Top Layer w0.381: J2.7 7.03,7.03 17.78,17.78 17.78,33.02 21.59,36.83 37.34,36.83 40.5,39.99 J1.7 ; U2.6 72.64,21.45 v1(72.64,19.05)
  Bottom Layer w0.381: v1(72.64,19.05) 71.65,20.04 71.65,45.27 70.13,46.79 45.12,46.79 J1.7
MOSI: length 120.3
  Top Layer w0.381: v1(71.17,18.54) 71.38,18.75 U2.7 ; J2.3 11.18,5.64 11.18,9.81 18.8,17.43 18.8,32.51 22.1,35.81 40.64,35.81 43.04,38.21 J1.6
  Bottom Layer w0.381: J1.6 47.18,46.3 69.01,46.3 71.17,44.15 v1(71.17,18.54)
NO_HV: length 6.2
  Top Layer w0.381: J3.1 52.94,11.23 U6.4
NO_LV: length 10.8
  Top Layer w0.381: U2.17 58.87,17.15 57.72,18.29 55.37,18.29 53.59,16.51 U6.2
RSRV1_HV: length 9
  Top Layer w0.381: U7.4 47.61,10.27 46.74,9.4 45.97,9.4 45.58,9 J3.7
RSRV1_LV: length 16.3
  Top Layer w0.381: U7.2 48.26,16.51 51.56,19.81 61.08,19.81 61.21,19.69
RSRV2: length 35.3
  Top Layer w0.381: v1(65.02,16) 61.34,16 U2.18
  Bottom Layer w0.381: v1(65.02,16) 65.02,10.16 58.42,3.56 44.44,3.56 J3.8
RSRV3: length 32
  Top Layer w0.381: v1(64.01,14.73) 61.34,14.73 U2.19
  Bottom Layer w0.381: J3.9 41.46,6.6 51.82,6.6 54.86,9.65 60.96,9.65 64.01,12.7 v1(64.01,14.73)
RSTO: length 36.3
  Top Layer w0.381: U2.10 67.56,21.45 v1(67.56,19.05)
  Bottom Layer w0.381: J1.1 56.78,43.21 60.2,43.21 69.72,33.69 69.72,21.21 v1(67.56,19.05)
RTS: length 16.9
  Top Layer w0.381: Q3.2 19.64,48.17 20.57,47.24 R21.1 21.58,45.46 22.1,45.97 25.65,45.97 26.29,45.34 U14.14
RX: length 104
  Top Layer w0.381: 25.02,33.2 v1(25.02,34.8) ; v1(73.91,2.03) 73.91,3.95 73.92,3.95
  Bottom Layer w0.381: v1(73.91,2.03) 73.41,2.54 62.74,2.54 61.47,1.27 17.53,1.27 13.21,5.59 13.21,20.57 14.73,22.1 19.81,22.1 21.08,23.37 21.08,30.27 25.02,34.21 v1(25.02,34.8) 25.15,34.8
SCK: length 124.1
  Top Layer w0.381: v1(38.35,36.58) 38.13,36.35 21.87,36.35 18.29,32.77 18.29,17.61 9.23,8.55 J2.5 ; 73.92,21.45 73.91,21.45 v1(73.91,19.56)
  Bottom Layer w0.381: v1(38.35,36.58) 38.35,41.77 J1.8 43.06,47.27 70.33,47.27 72.14,45.47 72.14,21.34 v1(73.91,19.56)
SD_DET: length 92
  Top Layer w0.381: U9.4 3.19,19.19 2.79,18.8 1.52,18.8 1.02,18.29 1.02,2.79 2.79,1.02 12.95,1.02 14.99,3.05 19.3,3.05 21.08,1.27 69.09,1.27 70.1,2.29 70.1,3.95 U2.33
SW_TYPE: length 17.2
  Top Layer w0.381: U2.22 59.06,10.8 58.42,11.43 ; 58.42,11.43 57.15,10.16 55.37,10.16 50.4,5.18 J3.6 ; 58.42,11.43 R7.1
SWITCH1: length 64.8
  Top Layer w0.381: U2.31 67.56,3.96 v1(67.56,6.1) ; v1(75.18,42.93) 75.18,48.77 78.23,51.82 78.23,57.43 U10.4
  Bottom Layer w0.381: v1(75.18,42.93) 77.98,40.13 77.98,10.67 73.41,6.1 v1(67.56,6.1)
SWITCH2: length 54.1
  Top Layer w0.381: U11.4 79.08,51.64 75.95,48.51 v1(75.95,43.43) ; v1(72.64,5.33) 72.64,3.96 U2.35
  Bottom Layer w0.381: v1(75.95,43.43) 78.49,40.89 78.49,10.16 73.66,5.33 v1(72.64,5.33)
TEMP: length 86.3
  Top Layer w0.381: v1(74.42,44.2) 74.42,43.66 74.04,43.28 U3.4 74.04,40.01 R4.1 ; U2.28 63.75,3.96 v1(63.75,5.59) ; J3.2 46.97,4.34 48.01,3.3 59.44,3.3 v1(60.2,4.06)
  Bottom Layer w0.381: v1(60.2,4.06) 63.86,4.06 ; 63.86,4.06 63.75,4.17 v1(63.75,5.59) ; 63.86,4.06 76.45,4.06 78.99,6.6 78.99,41.66 76.45,44.2 v1(74.42,44.2)
TX: length 103.9
  Top Layer w0.381: U2.37 75.18,3.95 v1(75.18,2.54) ; v1(26.29,34.8) U14.3
  Bottom Layer w0.381: v1(75.18,2.54) 74.68,3.05 62.48,3.05 61.19,1.75 17.81,1.75 13.97,5.59 13.97,20.32 14.99,21.34 20.07,21.34 21.59,22.86 21.59,30.1 v1(26.29,34.8)
USB_MODE: length 91.8
  Top Layer w0.381: v1(26.67,15.49) 27.69,15.49 27.94,15.75 27.94,16.93 U12.2 27.94,16.95 27.94,18.03 28.19,18.29 29.47,18.29 R11.2 30.74,14.22 v1(35.56,9.4) ; U2.20 61.34,13.46 v1(62.99,13.46) ; U13.4 8.29,39.88 6.6,39.88 5.84,39.12 5.84,27.42 R17.2 7.87,25.4 11.94,25.4 12.19,25.15 12.19,21.07 14.22,19.05 v1(16,19.05)
  Bottom Layer w0.381: v1(16,19.05) 19.56,15.49 v1(26.67,15.49) ; v1(35.56,9.4) 51.31,9.4 52.32,10.41 59.94,10.41 v1(62.99,13.46)
VRAW: length 33.8
  Top Layer w0.381: v1(19.56,25.4) 21.34,25.4 21.84,24.89 F2.2 ; C28.2 13.72,36.9 U13.1 11.97,35.08 11.68,34.8 9.65,34.8 8.89,34.04 8.89,31.5 8.13,30.73 8.13,28.51 ; v1(9.14,26.92) 9.14,28.23 U15.5 8.86,28.51 8.13,28.51 ; 8.13,28.51 C29.1
  Bottom Layer w0.381: v1(19.56,25.4) 10.67,25.4 v1(9.14,26.92)
VUSB: length 29.1
  Top Layer w0.381: D2.5 v1(27.43,9.14)
  Top Layer w0.508: F2.1 19.56,12.89 v1(19.56,11.94)
  Bottom Layer w0.381: 23.75,5.09 23,5.09
  Bottom Layer w0.508: v1(19.56,11.94) 17.78,10.16 17.78,9.4 18.54,8.64 22.49,8.64 23,9.14 24.13,9.14 24.51,8.76 25.78,8.76 25.91,8.64 26.92,8.64 v1(27.43,9.14) 27.43,8.89 28.7,7.62 28.7,6.1 28.19,5.59 24.25,5.59 23.75,5.09
$1N5366: length 2.7
  Top Layer w0.381: Q1.1 16.34,72.48 16,72.14
$1N5377: length 6.8
  Top Layer w0.381: Q1.3 11.71,75.69 D1.2 9.5,75.72 9.19,76.03 LS1.2
$1N8540: length 1.8
  Top Layer w0.381: R22.1 75.95,34.55 DS4.2
$3N949: length 4.1
  Top Layer w0.381: R5.1 12.65,82.61 C12.1 10.11,82.05 U5.8
$3N1025: length 151.8
  Top Layer w0.381: U5.3 v1(7.22,83.31)
  Bottom Layer w0.381: 7.11,83.31 v1(7.22,83.31) 17.27,83.31 21.08,79.5 21.08,49.28 22.1,48.26 66.29,48.26 67.56,49.53 67.56,90.68 69.09,92.2 82.8,92.2 DS1.1
$3N1030: length 9.1
  Top Layer w0.381: DS3.1 10.92,88.9 8.02,86 U5.2
$3N1036: length 10.2
  Top Layer w0.381: U5.1 8.82,85.53 v1(9.4,86.11)
  Bottom Layer w0.381: DS2.1 4.32,91.19 v1(9.4,86.11)
$3N2018: length 17.6
  Top Layer w0.381: R10.1 71.38,53.34 ; 71.38,53.34 71.39,53.34 U11.2 ; 71.38,53.34 71.38,52.38 ; S5.2 66.41,47.4 71.38,52.38 ; 71.38,52.38 C23.2
$3N2026: length 62.9
  Top Layer w0.381: R9.1 71.18,59.19 71.44,58.94 ; 71.44,58.94 C21.2 68.83,57.91 67.56,56.64 67.56,49.53 66.29,48.26 30.66,48.26 S4.2 ; 71.44,58.94 71.44,58.93 U10.2
$3N2473: length 18.1
  Top Layer w0.381: U8.2 83.31,71.56 81.79,73.08 81.79,75.94 R6.1 C19.2 81.47,78.23 76.96,78.23 75.75,79.44 S3.8
$3N3241: length 15
  Top Layer w0.381: 5.59,16.88 J2.9 J2.10 ; 5.59,16.88 2.93,16.88 2.54,17.27 U9.2 ; 5.59,16.88 C20.2 8.07,18.1 R8.2
$3N3342: length 6.8
  Top Layer w0.381: J3.4 40.13,9.32 40.13,10.41 37.59,12.95 F1.2
$4N1616: length 7.6
  Top Layer w0.381: U15.4 9.46,30.16 10.41,29.21 Q2.3 12.35,26.5 R14.2
$4N1624: length 1.9
  Top Layer w0.381: R17.1 9.3,24.14 Q2.1
$4N1628: length 1.8
  Top Layer w0.381: R12.2 R13.2
$4N1630: length 1.8
  Top Layer w0.381: R15.2 R16.2
$4N1632: length 3.6
  Top Layer w0.381: R16.1 12.95,31.39 U15.3
$4N1650: length 3.5
  Top Layer w0.381: R13.1 11.97,40.17 U13.3
$4N1730: length 2.9
  Top Layer w0.381: Q4.1 20.33,43.95 R21.2
$4N1732: length 2.3
  Top Layer w0.381: R18.2 16.14,47.74 Q3.1
$4N5448: length 5.9
  Top Layer w0.508: R20.2 27.18,5.07 v1(27.18,6.35)
  Bottom Layer w0.508: v1(27.18,6.35) 25.52,8.01 23.98,8.01 23.75,8.24
$4N5456: length 3
  Top Layer w0.508: R19.2 20.16,5.99 23,5.99

## Copper pours and planes (outline as drawn; the poured copper is in the pictures)
GND on Top Layer: -19.3,95.5 103.12,95.5 104.14,37.08 79,37.34 78.99,37.33 78.99,-1.27 -20.07,-1.27 -20.32,-1.02 -20.32,94.49
GND on Bottom Layer: -1.78,109.22 89.15,109.22 90.42,107.95 90.42,37.37 78.99,37.37 78.99,-2.79 -6.1,-2.79 -6.86,-2.03 -6.86,104.14

## Text on the board
Bottom Silkscreen Layer: SHED Makerspace | Jim Heaney | RIT | Access Control Core | Version 2.1.1, May 24
